# Altium project KOTROLER_TRANSPORTA.PrjPcb (part 2 of 2)

## Sheet PSU.SchDoc: Power supply
size A4; Author: eldar6776@hotmail.com; DrawnBy: Eldar Dedic; Organization: PROVEN d.o.o.; Address1: Adema Buće 102; Address2: 71000 Sarajevo; Address3: Federacija BiH; Address4: Bosna i Hercegovina; DocumentNumber: CD-26514; Revision: 001; SheetNumber: 6; SheetTotal: 8; ProjectName: KONTROLER TRANSPORTA MATERIJALA
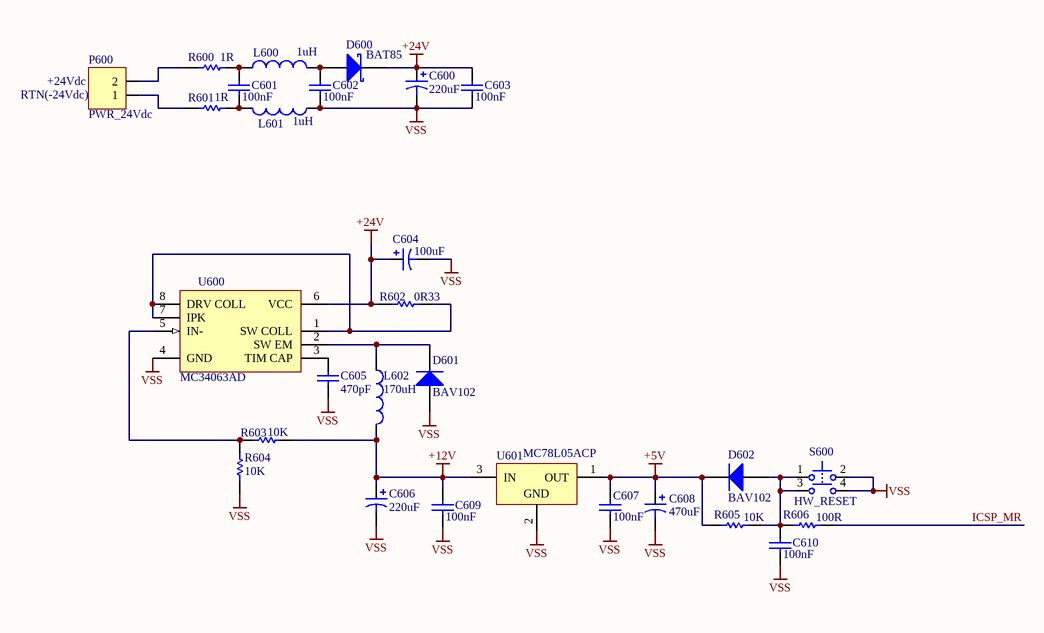
[diagram p5: PSU.SchDoc]

### Parts
C600  220uF  [E]
C601  value 100nF  [1206]
C602  value 100nF  [1206]
C603  value 100nF  [1206]
C604  100uF  [CAPPR2-5X11]
C605  value 470pF  [0805]
C606  220uF  [E]
C607  value 100nF  [1206]
C608  470uF  [CAPPR2-5X11]
C609  value 100nF  [1206]
C610  value 100nF  [1206]
D600  BAT85  [SOD68]
D601  BAV102  [SOD80C]
D602  BAV102  [SOD80C]
L600  value 1uH  [PCMC063T]
L601  value 1uH  [PCMC063T]
L602  value 170uH  [RB5-10.5]
P600  PWR_24Vdc  [TERMINAL BLOK 2]
R600  1R  [ERA-0805]
R601  1R  [ERA-0805]
R602  0R33  [ERA-0805]
R603  10K  [ERA-0805]
R604  10K  [ERA-0805]
R605  10K  [ERA-0805]
R606  100R  [ERA-0805]
S600  HW_RESET  [IT-2175]
U600  MC34063AD  [626-05]
U601  MC78L05ACP  [29-04]

### Nets
+5V: C607.2 C608.1 D602.2(K) R605.1 U601.1(OUT)
+12V: C606.1 C609.2 L602.2 R603.2 U601.3(IN)
+24V: C600.1 C603.2 C604.1 D600.2(K) R602.1 U600.6(VCC)
VSS: C600.2 C602.1 C603.1 C604.2 C605.1 C606.2 C607.1 C608.2 C609.1 C610.1 D601.1(A) L601.1 R604.1 S600.2 S600.4 U600.4(GND) U601.2(GND)
ICSP_MR: R606.2
NetC601_1: C601.1 L601.2 R601.1
NetC601_2: C601.2 L600.1 R600.1
NetC602_2: C602.2 D600.1(A) L600.2
NetC605_2: C605.2 U600.3(TIM_CAP)
NetC610_2: C610.2 D602.1(A) R605.2 R606.1 S600.1 S600.3
NetD601_2: D601.2(K) L602.1 U600.2(SW_EM)
NetP600_1: P600.1 R601.2
NetP600_2: P600.2 R600.2
NetR602_2: R602.2 U600.1(SW_COLL) U600.7(IPK) U600.8(DRV_COLL)
NetR603_1: R603.1 R604.2 U600.5(IN-)

### Notes on the sheet
- (near P600) RTN(-24Vdc)
- (near P600) +24Vdc
- Title
- Size:
- Date:
- A4
- Number:
- Time:
- Revision:
- Sheet
- of
- File:

### Library data of the parts
C600 C606 = 94SA107X0010EBP: Solid Aluminum Capacitor with Organic Semiconductor Electrolyte: 100uF, 10V, Bulk Pack; Note: Part Numbers shown are for ± 20% capacitance tolerance (X0).; PCB_Layout: Complies with Manufacturer's Recommendation.; DrillSize: Nominal, Rounded to the nearest 0.1mm; Published: 19-Mar-2004; DatasheetDocument: 29-Jun-2001; PackageReference: E; Publisher: Altium Limited; ComponentLink1Description: Manufacturer Link; ComponentLink1URL: http://www.vishay.com/; ComponentLink2Description: Datasheet; ComponentLink2URL: http://www.vishay.com/docs/90003/94sa.pdf; Value: 100uF
C601-C603 C607 C609 C610 = C1206: Ceramic Chip Capacitor - Standard; Published: 17-Jul-2002; LatestRevisionDate: 19-Mar-2004; LatestRevisionNote: Silkscreen size reduced.; DatasheetDocument: Mar-2001; PackageDocument: Mar-2001; PackageReference: 1206; Publisher: Altium Limited; Code_JEITA: 1206; Code_IPC: 3216 [1206]; ComponentLink1Description: Manufacturer Link; ComponentLink1URL: http://www.kemet.com/; ComponentLink2Description: Datasheet; ComponentLink2URL: http://www.kemet.com/kemet/web/homepage/kechome.nsf/vapubfilesname/F3102TA.pdf/$file/F3102TA.pdf
C604 C608 = EKA00AA210L00: Aluminum Electrolytic Capacitor, Radial Style with Long Leads: 10uF, 100V; Note: Refer to Manufacturer's Data Sheets for other lead formations; DrillSize: Nominal, Rounded To The Nearest 0.1mm; Published: 19-Mar-2004; DatasheetDocument: 20-Feb-2001; PackageReference: CAPPR2-5X11; Publisher: Altium Limited; ComponentLink1Description: Manufacturer Link; ComponentLink1URL: http://www.vishay.com/; ComponentLink2Description: Datasheet; ComponentLink2URL: http://www.vishay.com/docs/25014/eka.pdf; Value: 10uF
C605 = C0805: Ceramic Chip Capacitor - Standard; Note: Footprint corresponds to dimensions for bulk cassette packaging. This case size has tightened tolerances.; Published: 17-Jul-2002; LatestRevisionDate: 19-Mar-2004; LatestRevisionNote: Silkscreen size reduced.; DatasheetDocument: Mar-2001; PackageDocument: Mar-2001; PackageReference: 0805; Publisher: Altium Limited; Code_JEITA: 0805; Code_IPC: 2012[0805]; ComponentLink1Description: Manufacturer Link; ComponentLink1URL: http://www.kemet.com/; ComponentLink2Description: Datasheet; ComponentLink2URL: http://www.kemet.com/kemet/web/homepage/kechome.nsf/vapubfilesname/F3102TA.pdf/$file/F3102TA.pdf
D600 = BAT85: Schottky Barrier Diode; Published: 17-Sep-2003; DatasheetVersion: 25-May-2000; PackageVersion: May-2000; PackageReference: SOD68; Publisher: Altium Limited; PackageDescription: Diode, Axial; Body 3 x 1.6 mm (LxDia. max), Lead Dia. 0.55 mm (max); Code_JEDEC: DO-204-AG; ComponentLink1Description: Manufacturer Link; ComponentLink1URL: http://www.semiconductors.philips.com/; ComponentLink2Description: Datasheet; ComponentLink2URL: http://www.semiconductors.philips.com/acrobat/datasheets/BAT85_4.pdf
D601 D602 = BAV102: General-purpose Diode; Published: 17-Sep-2003; LatestRevisionDate: 19-Mar-2004; LatestRevisionNote: Silkscreen size reduced.; DatasheetVersion: 17-Sep-1996; PackageVersion: Jan-2002; PackageReference: SOD80C; Publisher: Altium Limited; PackageDescription: Metal Electrode Face (MELF) Diode; Body 3.5 x 1.6 mm (LxDia); ComponentLink1Description: Manufacturer Link; ComponentLink1URL: http://www.semiconductors.philips.com/; ComponentLink2Description: Datasheet; ComponentLink2URL: http://www.semiconductors.philips.com/acrobat/datasheets/BAV100_2.pdf
L600 L601 = PCMC063T-1R0MN: SMT Power Choke Coil; Size 7.3×6.6×3.0mm, ±20% Tolerance, 1.0uH, 11A; PCB_Layout: Complies with manufacturer's recommendation.; Published: 26-Sep-2008; DatasheetVersion: Oct-2007; PackageVersion: Oct-2007; PackageReference: PCMC063T; Publisher: Altium Limited; PackageDescription: SM Power Choke Coil; 2 Leads; Body 7.3 x 6.6 x 3.0 mm (LxWxH); ComponentLink1Description: Manufacturer Link; ComponentLink1URL: http://www.susumu.co.jp/; ComponentLink2Description: Datasheet; ComponentLink2URL: http://www.susumu.co.jp/english/pdf/products-j07-01.pdf
L602 = PCMC063T-R82MN: SMT Power Choke Coil; Size 7.3×6.6×3.0mm, ±20% Tolerance, 0.82uH, 13A; PCB_Layout: Complies with manufacturer's recommendation.; Published: 26-Sep-2008; DatasheetVersion: Oct-2007; PackageVersion: Oct-2007; PackageReference: PCMC063T; Publisher: Altium Limited; PackageDescription: SM Power Choke Coil; 2 Leads; Body 7.3 x 6.6 x 3.0 mm (LxWxH); ComponentLink1Description: Manufacturer Link; ComponentLink1URL: http://www.susumu.co.jp/; ComponentLink2Description: Datasheet; ComponentLink2URL: http://www.susumu.co.jp/english/pdf/products-j07-01.pdf
P600 = Terminal blok 2 pina: Terminal blok 2
R600-R606 = ERAS: Metal Film Thermosensitive Chip Resistor, 0.56 Ohm to 10k Ohm Range, 5% Tolerance, 0805 Size, 0.1 W; Note: If flow soldering, adjust pad width of PCB Footprint to 0.7 - 0.8 times the width of the resistor.; Published: 17-Dec-2003; LatestRevisionDate: 19-Mar-2004; LatestRevisionNote: Silkscreen size reduced.; PackageDocument: Mar-2003; PackageReference: ERA-0805; Publisher: Altium Limited; Code_IPC: 2012 [0805]; ComponentLink1Description: Manufacturer Link; ComponentLink1URL: http://www.panasonic.com/industrial/components/resistive_products.htm; ComponentLink2Description: Datasheet; ComponentLink2URL: http://www.panasonic.com/industrial/components/pdf/AOF0000CE1.pdf
S600 = IT-2175: Tactile Switch, DPST; Thru-Hole; Vertical; Rating DC 12V, 50mA (max); PackageDocument: Rev.0; Published: 6-Jun-2005; DatasheetDocument: Rev.0; PackageReference: IT-2175; Publisher: Altium Limited; ComponentLink1Description: Manufacturer Link; ComponentLink1URL: http://www.ilswitch.com/; ComponentLink2Description: Device Overview; ComponentLink2URL: http://www.ilswitch.com/list.php?ac_id=010112&ai_id=91
U600 = MC34063AD: DC-to-DC Converter Control Circuit; Published: 15-Apr-2002; LatestRevisionDate: 13-Apr-2006; LatestRevisionNote: IPC-7351 Footprint Added.; DatasheetVersion: 1996; PackageVersion: 1998; PackageReference: 751-05; Publisher: Altium Limited; PackageDescription: 8-Pin Small Outline Integrated Circuit 1.27 mm Pitch; Code_JEDEC: MS-012-AA; Code_IPC: SOIC127P600-8; ComponentLink1Description: Manufacturer Link; ComponentLink1URL: http://www.onsemi.com/site/products/taxonomy/0,4438,503,00.html; ComponentLink2Description: Datasheet; ComponentLink2URL: http://www.onsemi.com/pub/Collateral/MC34063A-D.PDF
U601 = MC78L05ACP: 3-Terminal Low-Current Positive Fixed Voltage Regulator; Published: 17-Jul-2002; DatasheetVersion: 1988; PackageVersion: 1996; PackageReference: 29-04; Publisher: Altium Limited; PackageDescription: TO, Flat Index; 3 In-Line, Axial Leads; Body Dia. 4.8mm; Leads 0.48 x 0.5 mm (max); ComponentLink1Description: Manufacturer Link; ComponentLink1URL: http://www.onsemi.com/site/products/taxonomy/0,4438,503,00.html; ComponentLink2Description: Datasheet; ComponentLink2URL: http://www.onsemi.com/pub/Collateral/MC78L00A-D.PDF

## Sheet SIGNAL_OUTPUT.SchDoc: Signal output
size A4; Author: eldar6776@hotmail.com; DrawnBy: Eldar Dedic; Organization: PROVEN d.o.o.; Address1: Adema Buće 102; Address2: 71000 Sarajevo; Address3: Federacija Bosne i Hercegovine; Address4: Bosna i Hercegovina; DocumentNumber: CD-26514; Revision: 001; SheetNumber: 7; SheetTotal: 8; ProjectName: KONTROLER TRANSPORTA MATERIJALA
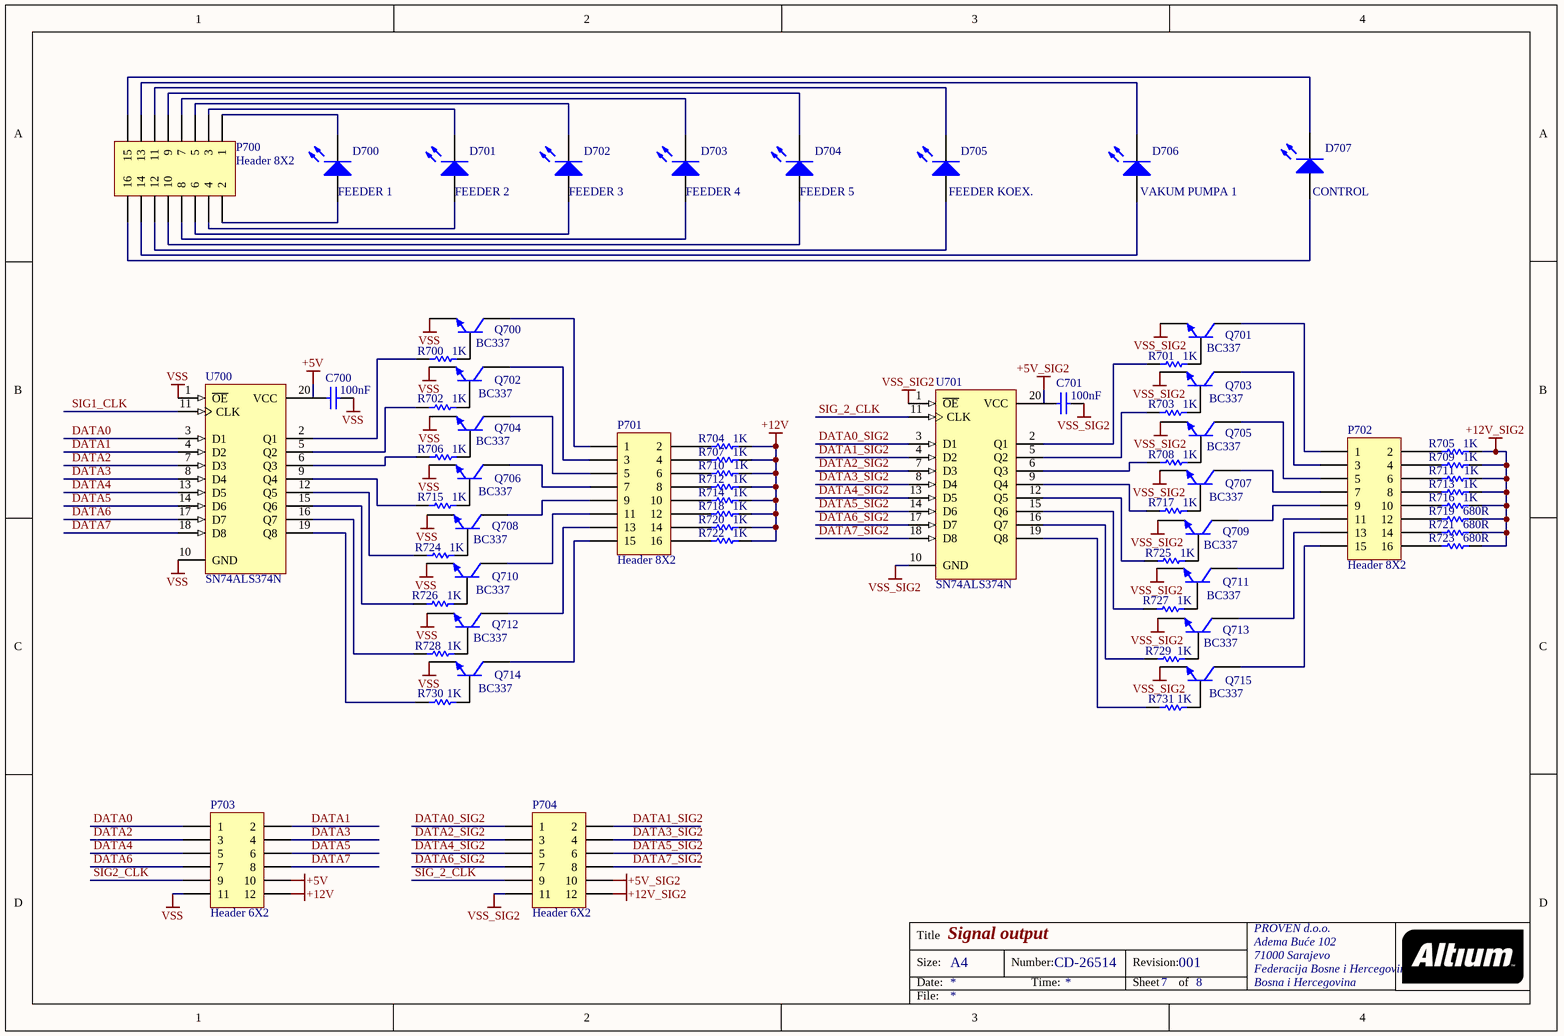
[diagram p6: SIGNAL_OUTPUT.SchDoc]

### Parts
C700  value 100nF  [1206]
C701  value 100nF  [1206]
D700  FEEDER 1  [LED-1]
D701  FEEDER 2  [LED-1]
D702  FEEDER 3  [LED-1]
D703  FEEDER 4  [LED-1]
D704  FEEDER 5  [LED-1]
D705  FEEDER KOEX.  [LED-1]
D706  VAKUM PUMPA 1  [LED-1]
D707  CONTROL  [LED-1]
P700  Header 8X2  [HDR2X8]
P701  Header 8X2  [HDR2X8]
P702  Header 8X2  [HDR2X8]
P703  Header 6X2  [HDR2X6]
P704  Header 6X2  [HDR2X6]
Q700  BC337  [29-04]
Q701  BC337  [29-04]
Q702  BC337  [29-04]
Q703  BC337  [29-04]
Q704  BC337  [29-04]
Q705  BC337  [29-04]
Q706  BC337  [29-04]
Q707  BC337  [29-04]
Q708  BC337  [29-04]
Q709  BC337  [29-04]
Q710  BC337  [29-04]
Q711  BC337  [29-04]
Q712  BC337  [29-04]
Q713  BC337  [29-04]
Q714  BC337  [29-04]
Q715  BC337  [29-04]
R700  1K  [ERA-0805]
R701  1K  [ERA-0805]
R702  1K  [ERA-0805]
R703  1K  [ERA-0805]
R704  1K  [ERA-0805]
R705  1K  [ERA-0805]
R706  1K  [ERA-0805]
R707  1K  [ERA-0805]
R708  1K  [ERA-0805]
R709  1K  [ERA-0805]
R710  1K  [ERA-0805]
R711  1K  [ERA-0805]
R712  1K  [ERA-0805]
R713  1K  [ERA-0805]
R714  1K  [ERA-0805]
R715  1K  [ERA-0805]
R716  1K  [ERA-0805]
R717  1K  [ERA-0805]
R718  1K  [ERA-0805]
R719  680R  [ERA-0805]
R720  1K  [ERA-0805]
R721  680R  [ERA-0805]
R722  1K  [ERA-0805]
R723  680R  [ERA-0805]
R724  1K  [ERA-0805]
R725  1K  [ERA-0805]
R726  1K  [ERA-0805]
R727  1K  [ERA-0805]
R728  1K  [ERA-0805]
R729  1K  [ERA-0805]
R730  1K  [ERA-0805]
R731  1K  [ERA-0805]
U700  SN74ALS374N  [N020D]
U701  SN74ALS374N  [N020D]

### Nets
+5V: C700.1 P703.10 U700.20(VCC)
+5V_SIG2: C701.1 P704.10 U701.20(VCC)
+12V: P703.12 R704.2 R707.2 R710.2 R712.2 R714.2 R718.2 R720.2 R722.2
+12V_SIG2: P704.12 R705.2 R709.2 R711.2 R713.2 R716.2 R719.2 R721.2 R723.2
VSS: C700.2 P703.11 Q700.3(E) Q702.3(E) Q704.3(E) Q706.3(E) Q708.3(E) Q710.3(E) Q712.3(E) Q714.3(E) U700.1(~{OE}) U700.10(GND)
VSS_SIG2: C701.2 P704.11 Q701.3(E) Q703.3(E) Q705.3(E) Q707.3(E) Q709.3(E) Q711.3(E) Q713.3(E) Q715.3(E) U701.1(~{OE}) U701.10(GND)
DATA0: P703.1 U700.3(D1)
DATA0_SIG2: P704.1 U701.3(D1)
DATA1: P703.2 U700.4(D2)
DATA1_SIG2: P704.2 U701.4(D2)
DATA2: P703.3 U700.7(D3)
DATA2_SIG2: P704.3 U701.7(D3)
DATA3: P703.4 U700.8(D4)
DATA3_SIG2: P704.4 U701.8(D4)
DATA4: P703.5 U700.13(D5)
DATA4_SIG2: P704.5 U701.13(D5)
DATA5: P703.6 U700.14(D6)
DATA5_SIG2: P704.6 U701.14(D6)
DATA6: P703.7 U700.17(D7)
DATA6_SIG2: P704.7 U701.17(D7)
DATA7: P703.8 U700.18(D8)
DATA7_SIG2: P704.8 U701.18(D8)
SIG1_CLK: U700.11(CLK)
SIG2_CLK: P703.9
SIG_2_CLK: P704.9 U701.11(CLK)
NetD700_1: D700.1(A) P700.2
NetD700_2: D700.2(K) P700.1
NetD701_1: D701.1(A) P700.4
NetD701_2: D701.2(K) P700.3
NetD702_1: D702.1(A) P700.6
NetD702_2: D702.2(K) P700.5
NetD703_1: D703.1(A) P700.8
NetD703_2: D703.2(K) P700.7
NetD704_1: D704.1(A) P700.10
NetD704_2: D704.2(K) P700.9
NetD705_1: D705.1(A) P700.12
NetD705_2: D705.2(K) P700.11
NetD706_1: D706.1(A) P700.14
NetD706_2: D706.2(K) P700.13
NetD707_1: D707.1(A) P700.16
NetD707_2: D707.2(K) P700.15
NetP701_1: P701.1 Q700.1(C)
NetP701_2: P701.2 R704.1
NetP701_3: P701.3 Q702.1(C)
NetP701_4: P701.4 R707.1
NetP701_5: P701.5 Q704.1(C)
NetP701_6: P701.6 R710.1
NetP701_7: P701.7 Q706.1(C)
NetP701_8: P701.8 R712.1
NetP701_9: P701.9 Q708.1(C)
NetP701_10: P701.10 R714.1
NetP701_11: P701.11 Q710.1(C)
NetP701_12: P701.12 R718.1
NetP701_13: P701.13 Q712.1(C)
NetP701_14: P701.14 R720.1
NetP701_15: P701.15 Q714.1(C)
NetP701_16: P701.16 R722.1
NetP702_1: P702.1 Q701.1(C)
NetP702_2: P702.2 R705.1
NetP702_3: P702.3 Q703.1(C)
NetP702_4: P702.4 R709.1
NetP702_5: P702.5 Q705.1(C)
NetP702_6: P702.6 R711.1
NetP702_7: P702.7 Q707.1(C)
NetP702_8: P702.8 R713.1
NetP702_9: P702.9 Q709.1(C)
NetP702_10: P702.10 R716.1
NetP702_11: P702.11 Q711.1(C)
NetP702_12: P702.12 R719.1
NetP702_13: P702.13 Q713.1(C)
NetP702_14: P702.14 R721.1
NetP702_15: P702.15 Q715.1(C)
NetP702_16: P702.16 R723.1
NetQ700_2: Q700.2(B) R700.1
NetQ701_2: Q701.2(B) R701.1
NetQ702_2: Q702.2(B) R702.1
NetQ703_2: Q703.2(B) R703.1
NetQ704_2: Q704.2(B) R706.1
NetQ705_2: Q705.2(B) R708.1
NetQ706_2: Q706.2(B) R715.1
NetQ707_2: Q707.2(B) R717.1
NetQ708_2: Q708.2(B) R724.1
NetQ709_2: Q709.2(B) R725.1
NetQ710_2: Q710.2(B) R726.1
NetQ711_2: Q711.2(B) R727.1
NetQ712_2: Q712.2(B) R728.1
NetQ713_2: Q713.2(B) R729.1
NetQ714_2: Q714.2(B) R730.1
NetQ715_2: Q715.2(B) R731.1
NetR700_2: R700.2 U700.2(Q1)
NetR701_2: R701.2 U701.2(Q1)
NetR702_2: R702.2 U700.5(Q2)
NetR703_2: R703.2 U701.5(Q2)
NetR706_2: R706.2 U700.6(Q3)
NetR708_2: R708.2 U701.6(Q3)
NetR715_2: R715.2 U700.9(Q4)
NetR717_2: R717.2 U701.9(Q4)
NetR724_2: R724.2 U700.12(Q5)
NetR725_2: R725.2 U701.12(Q5)
NetR726_2: R726.2 U700.15(Q6)
NetR727_2: R727.2 U701.15(Q6)
NetR728_2: R728.2 U700.16(Q7)
NetR729_2: R729.2 U701.16(Q7)
NetR730_2: R730.2 U700.19(Q8)
NetR731_2: R731.2 U701.19(Q8)

### Notes on the sheet
- Title
- Size:
- Date:
- A4
- Number:
- Time:
- Revision:
- Sheet
- of
- File:

### Library data of the parts
C700 C701 = C1206: Ceramic Chip Capacitor - Standard; Published: 17-Jul-2002; LatestRevisionDate: 19-Mar-2004; LatestRevisionNote: Silkscreen size reduced.; DatasheetDocument: Mar-2001; PackageDocument: Mar-2001; PackageReference: 1206; Publisher: Altium Limited; Code_JEITA: 1206; Code_IPC: 3216 [1206]; ComponentLink1Description: Manufacturer Link; ComponentLink1URL: http://www.kemet.com/; ComponentLink2Description: Datasheet; ComponentLink2URL: http://www.kemet.com/kemet/web/homepage/kechome.nsf/vapubfilesname/F3102TA.pdf/$file/F3102TA.pdf
D700-D707 = LED1: Typical RED GaAs LED; Published: 8-Jun-2000; LatestRevisionDate: 08-Jul-2005; LatestRevisionNote: Mech Layer 1 removed.; PackageReference: LED-1; Publisher: Altium Limited; PackageDescription: LED; 2 Leads
P700-P702 = Header 8X2: Header, 8-Pin, Dual row; LatestRevisionDate: 17-Jul-2002; LatestRevisionNote: Re-released for DXP Platform.; Publisher: Altium Limited
P703 P704 = Header 6X2: Header, 6-Pin, Dual row; LatestRevisionDate: 17-Jul-2002; LatestRevisionNote: Re-released for DXP Platform.; Publisher: Altium Limited
Q700-Q715 = BC337-16: Amplifier Transistor NPN Silicon; Published: 29-Sep-2000; LatestRevisionDate: 17-Jul-2002; LatestRevisionNote: Re-released for DXP Platform.; DatasheetVersion: 1991; PackageVersion: 1996; PackageReference: 29-04; Publisher: Altium Limited; PackageDescription: TO, Flat Index; 3 In-Line, Axial Leads; Body Dia. 4.8mm; Leads 0.48 x 0.5 mm (max); ComponentLink1Description: Manufacturer Link; ComponentLink1URL: http://www.onsemi.com/site/products/landing?taxonomyID=194; ComponentLink2Description: Datasheet; ComponentLink2URL: http://www.onsemi.com/pub/Collateral/BC337-D.PDF
R700-R731 = ERA6Y: Rectangular Thick Film Chip Resistor, 10 Ohm to 1M Ohm Range, 0.1% and 0.5% Tolerance, 0805 Size, 0.1 W; Note: If flow soldering, adjust pad width of PCB Footprint to 0.7 - 0.8 times the width of the resistor.; Published: 17-Dec-2003; LatestRevisionDate: 19-Mar-2004; LatestRevisionNote: Silkscreen size reduced.; PackageDocument: Mar-2003; PackageReference: ERA-0805; Publisher: Altium Limited; Code_IPC: 2012 [0805]; ComponentLink1Description: Manufacturer Link; ComponentLink1URL: http://www.panasonic.com/industrial/components/resistive_products.htm; ComponentLink2Description: Datasheet; ComponentLink2URL: http://www.panasonic.com/industrial/components/pdf/AOA0000CE8.pdf
U700 U701 = SN74ALS374N: Octal D-Type Edge-Triggered Flip-Flop with 3-State Outputs; Published: 8-Jun-2000; LatestRevisionDate: 04-Mar-2005; LatestRevisionNote: Stylized 3D Model Added.; DatasheetVersion: May-1986; PackageVersion: Oct-1995; PackageReference: N020D; Publisher: Altium Limited; PackageDescription: DIP; 20 Leads; Row Spacing 7.62 mm; Pitch 2.54 mm; ComponentLink1Description: Manufacturer Link; ComponentLink1URL: http://www.ti.com/

## Sheet ERROR_DISPLAY.SchDoc: Error display
size A4; Author: eldar6776@hotmail.com; DrawnBy: Eldar Dedić; Organization: PROVEN d.o.o.; Address1: Adema Buće 102; Address2: 71000 Sarajevo; Address3: Federacija BiH; Address4: Bosna i Hercegovina; DocumentNumber: CD-26514; Revision: 001; SheetNumber: 8; SheetTotal: 8; ProjectName: KONTROLER TRANSPORTA MATERIJALA
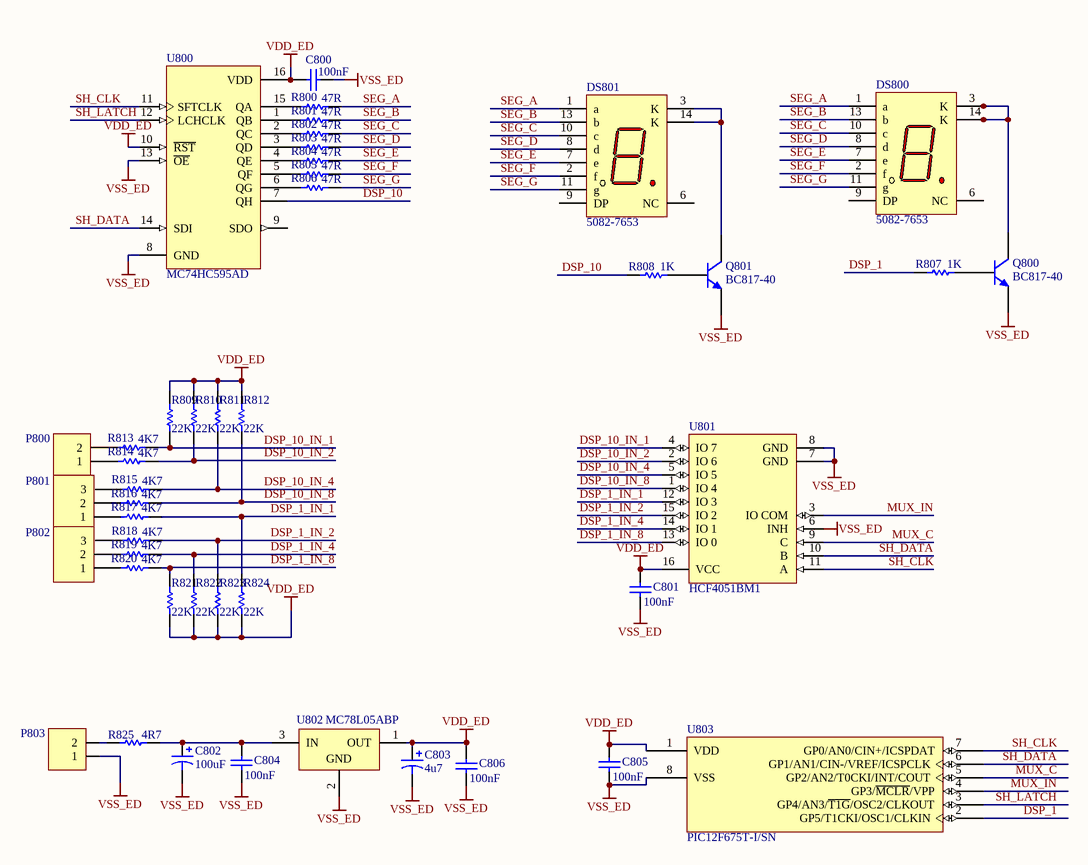
[diagram p7: ERROR_DISPLAY.SchDoc]

### Parts
C800  value 100nF  [0805]
C801  value 100nF  [0805]
C802  100uF  [C]
C803  4u7  [B]
C804  value 100nF  [0805]
C805  value 100nF  [0805]
C806  value 100nF  [0805]
DS800  5082-7653  [E-11(R)]
DS801  5082-7653  [E-11(R)]
P800  (no value)  [TERMINAL BLOK 2]
P801  (no value)  [TERMINAL BLOK]
P802  (no value)  [TERMINAL BLOK]
P803  (no value)  [TERMINAL BLOK 2]
Q800  BC817-40  [SOT23_N]
Q801  BC817-40  [SOT23_N]
R800  47R  [ERA-0603]
R801  47R  [ERA-0603]
R802  47R  [ERA-0603]
R803  47R  [ERA-0603]
R804  47R  [ERA-0603]
R805  47R  [ERA-0603]
R806  47R  [ERA-0603]
R807  1K  [ERA-0603]
R808  1K  [ERA-0603]
R809  22K  [ERA-0603]
R810  22K  [ERA-0603]
R811  22K  [ERA-0603]
R812  22K  [ERA-0603]
R813  4K7  [ERA-0603]
R814  4K7  [ERA-0603]
R815  4K7  [ERA-0603]
R816  4K7  [ERA-0603]
R817  4K7  [ERA-0603]
R818  4K7  [ERA-0603]
R819  4K7  [ERA-0603]
R820  4K7  [ERA-0603]
R821  22K  [ERA-0603]
R822  22K  [ERA-0603]
R823  22K  [ERA-0603]
R824  22K  [ERA-0603]
R825  4R7  [RD3.2x1.7]
U800  MC74HC595AD  [751B-05_N]
U801  HCF4051BM1  [SO16_N]
U802  MC78L05ABP  [29-04]
U803  PIC12F675T-I/SN  [SOIC-SN8_N]

### Nets
VDD_ED: C800.2 C801.1 C803.1 C805.1 C806.1 R809.2 R810.2 R811.2 R812.2 R821.1 R822.1 R823.1 R824.1 U800.10(~{RST}) U800.16(VDD) U801.16(VCC) U802.1(OUT) U803.1(VDD)
VSS_ED: C800.1 C801.2 C802.2 C803.2 C804.2 C805.2 C806.2 P803.1 Q800.2(E) Q801.2(E) U800.8(GND) U800.13(~{OE}) U801.6(INH) U801.7(GND) U801.8(GND) U802.2(GND) U803.8(VSS)
DSP_1: R807.1 U803.2(GP5/T1CKI/OSC1/CLKIN)
DSP_1_IN_1: R817.2 R824.2 U801.12(IO_3)
DSP_1_IN_2: R818.2 R823.2 U801.15(IO_2)
DSP_1_IN_4: R819.2 R822.2 U801.14(IO_1)
DSP_1_IN_8: R820.2 R821.2 U801.13(IO_0)
DSP_10: R808.1 U800.7(QH)
DSP_10_IN_1: R809.1 R813.2 U801.4(IO_7)
DSP_10_IN_2: R810.1 R814.2 U801.2(IO_6)
DSP_10_IN_4: R811.1 R815.2 U801.5(IO_5)
DSP_10_IN_8: R812.1 R816.2 U801.1(IO_4)
MUX_C: U801.9(C) U803.5(GP2/AN2/T0CKI/INT/COUT)
MUX_IN: U801.3(IO_COM) U803.4(GP3/~{MCLR}/VPP)
SEG_A: DS800.1(a) DS801.1(a) R800.2
SEG_B: DS800.13(b) DS801.13(b) R801.2
SEG_C: DS800.10(c) DS801.10(c) R802.2
SEG_D: DS800.8(d) DS801.8(d) R803.2
SEG_E: DS800.7(e) DS801.7(e) R804.2
SEG_F: DS800.2(f) DS801.2(f) R805.2
SEG_G: DS800.11(g) DS801.11(g) R806.2
SH_CLK: U800.11(SFTCLK) U801.11(A) U803.7(GP0/AN0/CIN+/ICSPDAT)
SH_DATA: U800.14(SDI) U801.10(B) U803.6(GP1/AN1/CIN-/VREF/ICSPCLK)
SH_LATCH: U800.12(LCHCLK) U803.3(GP4/AN3/~{T1G}/OSC2/CLKOUT)
NetC802_1: C802.1 C804.1 R825.2 U802.3(IN)
NetDS800_3: DS800.3(K) DS800.14(K) Q800.3(C)
NetDS801_3: DS801.3(K) DS801.14(K) Q801.3(C)
NetP800_1: P800.1 R814.1
NetP800_2: P800.2 R813.1
NetP801_1: P801.1 R817.1
NetP801_2: P801.2 R816.1
NetP801_3: P801.3 R815.1
NetP802_1: P802.1 R820.1
NetP802_2: P802.2 R819.1
NetP802_3: P802.3 R818.1
NetP803_2: P803.2 R825.1
NetQ800_1: Q800.1(B) R807.2
NetQ801_1: Q801.1(B) R808.2
NetR800_1: R800.1 U800.15(QA)
NetR801_1: R801.1 U800.1(QB)
NetR802_1: R802.1 U800.2(QC)
NetR803_1: R803.1 U800.3(QD)
NetR804_1: R804.1 U800.4(QE)
NetR805_1: R805.1 U800.5(QF)
NetR806_1: R806.1 U800.6(QG)

Not connected (* = marked no-connect by the designer): DS800 6(NC) 9(DP); DS801 6(NC) 9(DP); U800 9(SDO)

### Notes on the sheet
- Title
- Size:
- Date:
- A4
- Number:
- Time:
- Revision:
- Sheet
- of
- File:

### Library data of the parts
C800 C801 C804-C806 = C0805: as C605 on sheet PSU; Published: 17-Jul-2002; LatestRevisionDate: 19-Mar-2004; LatestRevisionNote: Silkscreen size reduced.; DatasheetDocument: Mar-2001; PackageDocument: Mar-2001; PackageReference: 0805; Publisher: Altium Limited; Code_JEITA: 0805; Code_IPC: 2012[0805]; ComponentLink1Description: Manufacturer Link; ComponentLink1URL: http://www.kemet.com/; ComponentLink2Description: Datasheet; ComponentLink2URL: http://www.kemet.com/kemet/web/homepage/kechome.nsf/vapubfilesname/F3102TA.pdf/$file/F3102TA.pdf
C802 = 94SC106X0025CBP: Solid Aluminum Capacitor with Organic Semiconductor Electrolyte: 10uF, 25V, Bulk Pack; Note: Part Numbers shown are for ± 20% capacitance tolerance (X0).; PCB_Layout: Complies with Manufacturer's Recommendation.; DrillSize: Nominal, Rounded to the nearest 0.1mm; Published: 19-Mar-2004; DatasheetDocument: 23-May-2001; PackageReference: C; Publisher: Altium Limited; ComponentLink1Description: Manufacturer Link; ComponentLink1URL: http://www.vishay.com/; ComponentLink2Description: Datasheet; ComponentLink2URL: http://www.vishay.com/docs/90004/94sc.pdf; Value: 10uF
C803 = 94SC225X0030BBP: Solid Aluminum Capacitor with Organic Semiconductor Electrolyte: 2.2uF, 30V, Bulk Pack; Note: Part Numbers shown are for ± 20% capacitance tolerance (X0).; PCB_Layout: Complies with Manufacturer's Recommendation.; DrillSize: Nominal, Rounded to the nearest 0.1mm; Published: 19-Mar-2004; DatasheetDocument: 23-May-2001; PackageReference: B; Publisher: Altium Limited; ComponentLink1Description: Manufacturer Link; ComponentLink1URL: http://www.vishay.com/; ComponentLink2Description: Datasheet; ComponentLink2URL: http://www.vishay.com/docs/90004/94sc.pdf; Value: 2.2uF
DS800 DS801 = 5082-7653: 10.92 mm HER 7-Segment Display: CC, RH DP; LuminousIntensity: 340 ucd (Minimum).; LED_Colour: High Efficiency Red (HER); Note: Pins 3 and 14 are redundant Cathodes.; Note: No pins are present in positions 4, 5 and 12.; Published: 26-May-2004; LatestRevisionDate: 11-Oct-2004; LatestRevisionNote: Display outline superimposed on PCB Footprint.; DatasheetDocument: 27-Aug-2001; PackageDocument: 11-Mar-2003; PackageReference: E-11(R); Publisher: Altium Limited; ComponentLink1Description: Manufacturer Link; ComponentLink1URL: http://www.agilent.com/; ComponentLink2Description: Datasheet; ComponentLink2URL: http://cp.literature.agilent.com/litweb/pdf/5988-3325EN.pdf
P800 P803 = Terminal blok 2 pina: Terminal blok 2
P801 P802 = Terminal blok 3 pina: Terminal blok
Q800 Q801 = BC817-40: NPN General-purpose Transistor; Published: 17-Sep-2003; LatestRevisionDate: 12-Dec-2006; LatestRevisionNote: IPC-7351 Footprint Added.; DatasheetVersion: Jun-1999; PackageVersion: May-1999; PackageReference: SOT23; Publisher: Altium Limited; PackageDescription: 3-Pin SOT-23 Package 0.95 mm Pitch, 2.3 mm Lead Span; ComponentLink1Description: Manufacturer Link; ComponentLink1URL: http://www.semiconductors.philips.com/; ComponentLink2Description: Datasheet; ComponentLink2URL: http://www.semiconductors.philips.com/acrobat/datasheets/BC817_BC817W_BC337_5.pdf
R800-R824 = ERA3Y: Rectangular Thick Film Chip Resistor, 10 Ohm to 330k Ohm Range, 0.1% and 0.5% Tolerance, 0603 Size, 0.063 W; Note: If flow soldering, adjust pad width of PCB Footprint to 0.7 - 0.8 times the width of the resistor.; Published: 17-Dec-2003; LatestRevisionDate: 19-Mar-2004; LatestRevisionNote: Silkscreen size reduced.; PackageDocument: Mar-2003; PackageReference: ERA-0603; Publisher: Altium Limited; Code_IPC: 1608 [0603]; ComponentLink1Description: Manufacturer Link; ComponentLink1URL: http://www.panasonic.com/industrial/components/resistive_products.htm; ComponentLink2Description: Datasheet; ComponentLink2URL: http://www.panasonic.com/industrial/components/pdf/AOA0000CE8.pdf
R825 = ERD6FC: Flame-Retardant Fuse Type Carbon Film Resistor, 4.7 Ohm to 1k Ohm Range, 2% and 5% Tolerance, 0.166 W; Published: 17-Dec-2003; PackageReference: RD3.2x1.7; Publisher: Altium Limited; ComponentLink1Description: Manufacturer Link; ComponentLink1URL: http://www.panasonic.com/industrial/components/resistive_products.htm; ComponentLink2Description: Datasheet; ComponentLink2URL: http://www.panasonic.com/industrial/components/pdf/AOB0000CE5.pdf
U800 = MC74HC595AD: 8-Bit Serial-Input/Serial or Prallel-Output Shift Register with Latched 3-State Outputs; Published: 15-Apr-2002; LatestRevisionDate: 13-Apr-2006; LatestRevisionNote: IPC-7351 Footprint Added.; DatasheetVersion: Mar-2000; PackageVersion: Oct-1999; PackageReference: 751B-05; Publisher: Altium Limited; PackageDescription: 16-Pin Small Outline Integrated Circuit 1.27 mm Pitch; Code_JEDEC: MS-012-AC; Code_IPC: SOIC127P600-16; ComponentLink1Description: Manufacturer Link; ComponentLink1URL: http://www.onsemi.com/; ComponentLink2Description: Datasheet; ComponentLink2URL: http://www.onsemi.com/pub/Collateral/MC74HC595A-D.PDF
U801 = HCF4051BM1: Analog Multiplexer/Demultiplexer; Published: 8-Jun-2000; LatestRevisionDate: 13-Apr-2006; LatestRevisionNote: IPC-7351 Footprint Added.; DatasheetVersion: Jun-1989; PackageVersion: May-1998; PackageReference: SO16; Publisher: Altium Limited; PackageDescription: 16-Pin Small Outline Integrated Circuit 1.27 mm Pitch; Code_IPC: SOIC127P600-16; ComponentLink1Description: Manufacturer Link; ComponentLink1URL: http://www.st.com/; ComponentLink2Description: Datasheet; ComponentLink2URL: http://www.st.com/stonline/products/literature/ds/2053/hcf4051.pdf
U802 = MC78L05ABP: Three-Terminal Low Current Positive Voltage Regulator; Published: 15-Apr-2002; DatasheetVersion: Oct-1999; PackageVersion: 1996; PackageReference: 29-04; Publisher: Altium Limited; PackageDescription: TO, Flat Index; 3 In-Line, Axial Leads; Body Dia. 4.8mm; Leads 0.48 x 0.51 mm (max); ComponentLink1Description: Manufacturer Link; ComponentLink1URL: http://www.onsemi.com/site/products/taxonomy/0,4438,503,00.html; ComponentLink2Description: Datasheet; ComponentLink2URL: http://www.onsemi.com/pub/Collateral/MC78L00A-D.PDF
U803 = PIC12F675T-I/SN: FLASH-Based 8-Bit CMOS Microcontroller, 10-Bit A/D, 8-Pin SOIC 150mil, Industrial Temperature, Tape and Reel; Note: Refer to data sheet (DS41190F) for details of supply voltage range under different conditions.; Published: 11-Oct-2004; LatestRevisionDate: 02-Dec-2009; LatestRevisionNote: Updated to datasheet revision revF, Sep-2009.; DatasheetVersion: revF, Sep-2009; PackageVersion: revBB, Aug-2009; PackageReference: SOIC-SN8; Publisher: Altium Limited; PackageDescription: 8-Lead Plastic Small Outline (SN) - Narrow, 3.90mm Body [SOIC]; Supplier 1: Digi-Key; Supplier Part Number 1: PIC12F675T-I/SNTR-ND; Supplier 2: Farnell; Supplier Part Number 2: 1816055; Code_JEDEC: MS-012; Code_IPC: SOIC127P600-8; ComponentLink1Description: Datasheet; ComponentLink1URL: http://ww1.microchip.com/downloads/en/DeviceDoc/41190F.pdf; ComponentLink2Description: Packaging Specification; ComponentLink2URL: http://www.microchip.com/stellent/groups/techpub_sg/documents/packagingspec/en012702.pdf; ComponentLink3Description: Microchip.com Home; ComponentLink3URL: http://www.microchip.com/

## Nets that join several sheets
+5V: ANALOG_INPUT (P101.2), ANALOG_OUTPUT (P205.10), CUC (20 pins), DIGITAL_INPUT (7 pins), DIGITAL_OUTPUT (P500.13 P514.13), PSU (5 pins), SIGNAL_OUTPUT (C700.1 P703.10 U700.20)
+12V: ANALOG_OUTPUT (C200.2 C201.1 P205.9 U200.4), DIGITAL_OUTPUT (P500.12 P514.12), PSU (5 pins), SIGNAL_OUTPUT (9 pins)
+24V: DIGITAL_INPUT (7 pins), PSU (6 pins)
VSS: ANALOG_INPUT (5 pins), ANALOG_OUTPUT (15 pins), CUC (11 pins), DIGITAL_INPUT (61 pins), DIGITAL_OUTPUT (P500.11 P500.14 P514.11 P514.14), PSU (17 pins), SIGNAL_OUTPUT (12 pins)
AN0_IN: ANALOG_INPUT (P101.3), CUC (U301.2)
AN1_IN: ANALOG_INPUT (P101.4), CUC (U301.3)
AN2_IN: ANALOG_INPUT (P101.5), CUC (U301.4)
AN3_IN: ANALOG_INPUT (P101.6), CUC (U301.5)
AN4_IN: ANALOG_INPUT (P101.7), CUC (U301.7)
AN5_IN: ANALOG_INPUT (P101.8), CUC (U301.8)
AN6_IN: ANALOG_INPUT (P101.9), CUC (U301.9)
CLOCK: ANALOG_OUTPUT (P205.2), CUC (U300.11 U301.18)
DAC1_CS: ANALOG_OUTPUT (P205.1), CUC (U301.37)
DAC1_LATCH: ANALOG_OUTPUT (P205.4), CUC (U301.36)
DATA: ANALOG_OUTPUT (P205.3), CUC (U300.14 U301.24)
DATA0: CUC (R305.1 U301.19), DIGITAL_INPUT (P415.1 U400.18 U401.18 U402.18), DIGITAL_OUTPUT (P500.1 P514.1), SIGNAL_OUTPUT (P703.1 U700.3)
DATA1: CUC (R306.1 U301.20), DIGITAL_INPUT (P415.2 U400.16 U401.16 U402.16), DIGITAL_OUTPUT (P500.2 P514.2), SIGNAL_OUTPUT (P703.2 U700.4)
DATA2: CUC (R307.1 U301.21), DIGITAL_INPUT (P415.3 U400.14 U401.14 U402.14), DIGITAL_OUTPUT (P500.3 P514.3), SIGNAL_OUTPUT (P703.3 U700.7)
DATA3: CUC (R308.1 U301.22), DIGITAL_INPUT (P415.4 U400.12 U401.12 U402.12), DIGITAL_OUTPUT (P500.4 P514.4), SIGNAL_OUTPUT (P703.4 U700.8)
DATA4: CUC (R309.1 U301.27), DIGITAL_INPUT (P415.5 U400.9 U401.9 U402.9), DIGITAL_OUTPUT (P500.5 P514.5), SIGNAL_OUTPUT (P703.5 U700.13)
DATA5: CUC (R310.1 U301.28), DIGITAL_INPUT (P415.6 U400.7 U401.7 U402.7), DIGITAL_OUTPUT (P500.6 P514.6), SIGNAL_OUTPUT (P703.6 U700.14)
DATA6: CUC (R311.1 U301.29), DIGITAL_INPUT (P415.7 U400.5 U401.5 U402.5), DIGITAL_OUTPUT (P500.7 P514.7), SIGNAL_OUTPUT (P703.7 U700.17)
DATA7: CUC (R312.1 U301.30), DIGITAL_INPUT (P415.8 U400.3 U401.3 U402.3), DIGITAL_OUTPUT (P500.8 P514.8), SIGNAL_OUTPUT (P703.8 U700.18)
EXTRUDER_RUN: ANALOG_INPUT (C108.1 D100.2 R107.1 R108.1), CUC (U301.10)
ICSP_MR: CUC (P300.1 U301.1), PSU (R606.2)
INPUT_1_8: CUC (U300.15), DIGITAL_INPUT (U400.1 U400.19)
INPUT_9_16: CUC (U300.1), DIGITAL_INPUT (U401.1 U401.19)
INPUT_17_24: CUC (U300.2), DIGITAL_INPUT (U402.1 U402.19)
INPUT_25_32: CUC (U300.3), DIGITAL_INPUT (P415.9)
OUT1_CLK: CUC (U300.4), DIGITAL_OUTPUT (P514.10)
OUT2_CLK: CUC (U300.5), DIGITAL_OUTPUT (P500.10)
OUTPUT_ENABLE: CUC (U300.6), DIGITAL_OUTPUT (P500.9 P514.9)
PWM1_OUT: ANALOG_OUTPUT (R203.1), CUC (U301.16)
PWM2_OUT: ANALOG_OUTPUT (R209.1), CUC (U301.17)
SIG1_CLK: CUC (U301.34), SIGNAL_OUTPUT (U700.11)
SIG2_CLK: CUC (U301.35), SIGNAL_OUTPUT (P703.9)